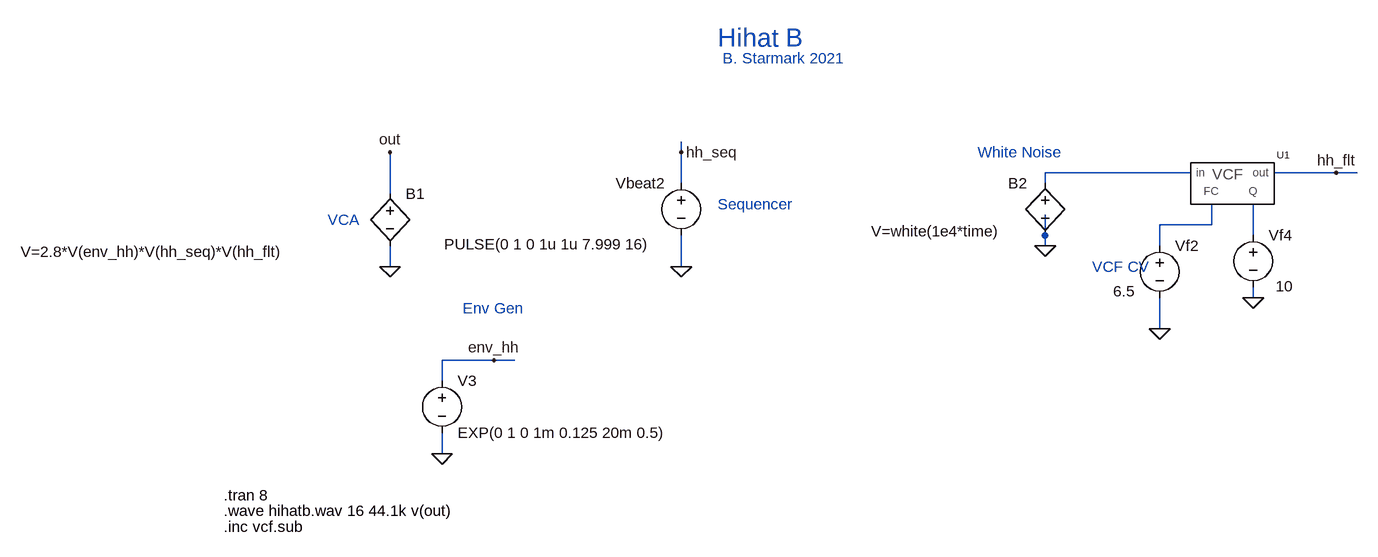
[diagram p0: schematic hihatb.asc]
hihatb.asc, the LTspice schematic file:
Version 4
SHEET 1 2536 1252
WIRE 640 512 640 496
WIRE 1424 544 1200 544
WIRE 1648 544 1552 544
WIRE 1680 544 1648 544
WIRE 640 560 640 512
WIRE 1200 560 1200 544
WIRE 192 576 192 512
WIRE 1456 624 1456 592
WIRE 1456 624 1376 624
WIRE 1200 640 1200 608
WIRE 1520 640 1520 592
WIRE 1200 656 1200 640
WIRE 1376 656 1376 624
WIRE 192 688 192 656
WIRE 640 688 640 640
WIRE 1520 736 1520 720
WIRE 1376 784 1376 736
WIRE 352 832 272 832
WIRE 384 832 352 832
WIRE 272 864 272 832
WIRE 272 976 272 944
FLAG 192 512 out
FLAG 640 688 0
FLAG 640 512 hh_seq
FLAG 192 688 0
FLAG 1648 544 hh_flt
FLAG 1200 656 0
FLAG 272 976 0
FLAG 352 832 env_hh
FLAG 1520 736 0
FLAG 1376 784 0
SYMBOL bv 192 560 R0
WINDOW 3 -568 105 Left 2
SYMATTR Value V=2.8*V(env_hh)*V(hh_seq)*V(hh_flt)
SYMATTR InstName B1
SYMBOL voltage 640 544 M0
WINDOW 123 24 124 Left 2
WINDOW 39 0 0 Left 2
WINDOW 3 47 110 Left 2
SYMATTR Value PULSE(0 1 0 1u 1u 7.999 16)
SYMATTR InstName Vbeat2
SYMBOL bv 1200 544 R0
WINDOW 0 -57 16 Left 2
WINDOW 3 -268 90 Left 2
SYMATTR InstName B2
SYMATTR Value V=white(1e4*time)
SYMBOL voltage 272 848 R0
WINDOW 123 0 0 Left 0
WINDOW 39 0 0 Left 0
SYMATTR InstName V3
SYMATTR Value EXP(0 1 0 1m 0.125 20m 0.5)
SYMBOL voltage 1376 640 R0
WINDOW 123 0 0 Left 0
WINDOW 39 0 0 Left 0
WINDOW 3 -71 86 Left 2
SYMATTR Value 6.5
SYMATTR InstName Vf2
SYMBOL vcf 1488 512 R0
SYMATTR InstName U1
SYMBOL voltage 1520 624 R0
WINDOW 123 0 0 Left 0
WINDOW 39 0 0 Left 0
WINDOW 3 35 94 Left 2
SYMATTR Value 10
SYMATTR InstName Vf4
TEXT -64 1040 Left 2 !.tran 8
TEXT 304 752 Left 2 ;Env Gen
TEXT 696 592 Left 2 ;Sequencer
TEXT 96 616 Left 2 ;VCA
TEXT 1096 512 Left 2 ;White Noise
TEXT -64 1064 Left 2 !.wave hihatb.wav 16 44.1k v(out)
TEXT 696 336 Left 4 ;Hihat B
TEXT 704 368 Left 2 ;B. Starmark 2021
TEXT 1272 688 Left 2 ;VCF CV
TEXT -64 1088 Left 2 !.inc vcf.sub

The netlist it stands for:
* hihatb.asc
B1 out 0 V=2.8*V(env_hh)*V(hh_seq)*V(hh_flt)
Vbeat2 hh_seq 0 PULSE(0 1 0 1u 1u 7.999 16)
B2 N001 0 V=white(1e4*time)
V3 env_hh 0 EXP(0 1 0 1m 0.125 20m 0.5)
Vf2 N002 0 6.5
XU1 N001 hh_flt N002 N003 vcf  ; pins in out FC Q
Vf4 N003 0 10
.tran 8
* Env Gen
* Sequencer
* VCA
* White Noise
.wave hihatb.wav 16 44.1k v(out)
* Hihat B
* B. Starmark 2021
* VCF CV
.inc vcf.sub
.backanno
.end